# EAGLE design gardener (EAGLE 7.6.0)
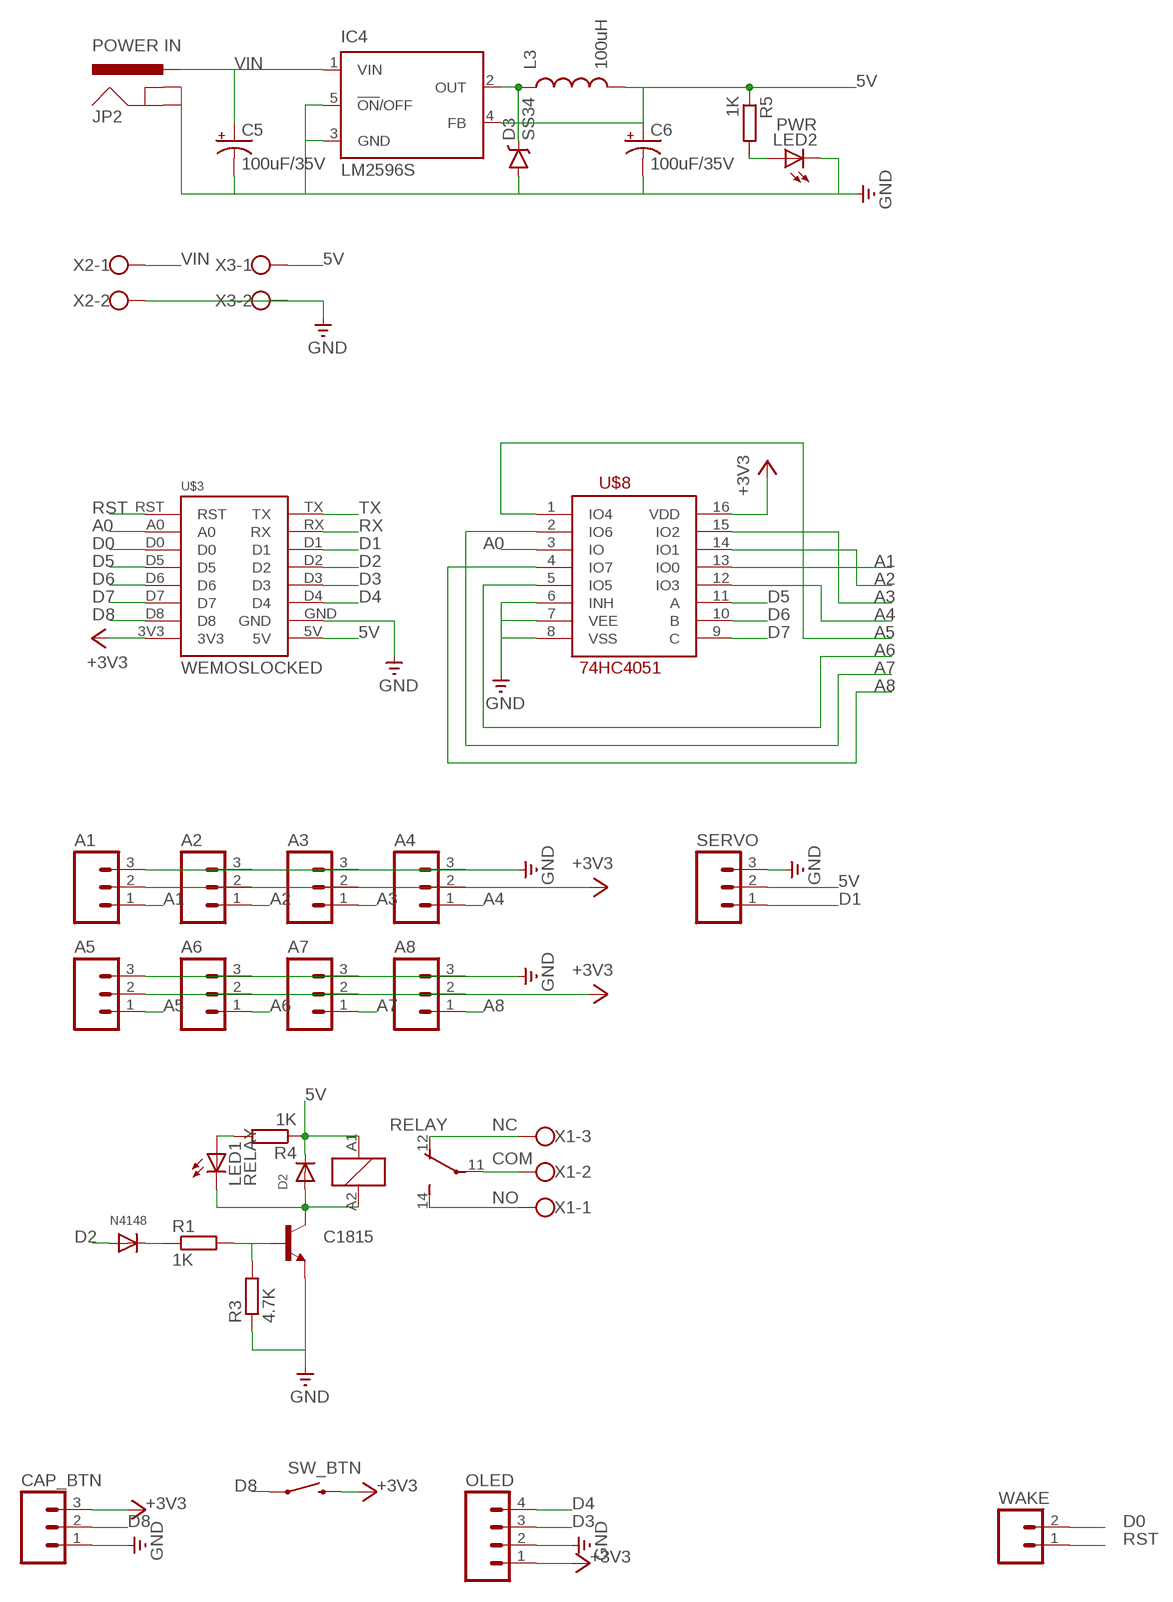
[diagram p0: schematic, sheet 1]

## Parts
A1  M03PTH  [1X03]
A2  M03PTH  [1X03]
A3  M03PTH  [1X03]
A4  M03PTH  [1X03]
A5  M03PTH  [1X03]
A6  M03PTH  [1X03]
A7  M03PTH  [1X03]
A8  M03PTH  [1X03]
C5  100uF/35V  CAP_POLD  [PANASONIC_D]
C6  100uF/35V  CAP_POLD  [PANASONIC_D]
C1815  TRANSISTOR_NPNSOT23-3  [SOT23-3]
CAP_BTN  M03PTH  [1X03]
D2  DIODESMA  [SMADIODE]
D3  SS34  MBRA140  [SMA-DIODE]
IC4  LM2596S  [TO263-5]
JP2  POWER IN  POWER_JACKPTH  [POWER_JACK_PTH]
L3  100uH  INDUCTORSDR13-7-270ML  [INDUCTOR_SDR1307]
LED1  RELAY  LED3MM  [LED3MM]
LED2  PWR  LED3MM  [LED3MM]
N4148  DIODESOD-123  [SOD-123]
OLED  M04PTH  [1X04]
R1  1K  R-EU_R0805  [R0805]
R3  4.7K  R-EU_R0805  [R0805]
R4  1K  R-EU_R0805  [R0805]
R5  1K  R-EU_R0805  [R0805]
RELAY  ZNS5106  [ZN5]
SERVO  M03PTH  [1X03]
SW_BTN  SWITCH-MOMENTARY-212MM  [TACTILE-PTH-12MM]
U$3  WEMOSLOCKED  [WEMOS_LOCKED]
U$8  74HC4051  [74HC4051]
WAKE  M02PTH  [1X02]
X1  W237-103  [W237-103]
X2  W237-102  [W237-102]
X3  W237-102  [W237-102]

## Nets
5V: C6.+ D2.C IC4.4(FB) L3.P$2 R4.1 R5.1 RELAY.A1 SERVO.2 U$3.5V X3.1
+3V3: A1.2 A2.2 A3.2 A4.2 A5.2 A6.2 A7.2 A8.2 CAP_BTN.3 OLED.1 SW_BTN.3 U$3.3V3 U$8.16(VDD)
A0: U$3.A0 U$8.3(IO)
A1: A1.1 U$8.13(IO0)
A2: A2.1 U$8.14(IO1)
A3: A3.1 U$8.15(IO2)
A4: A4.1 U$8.12(IO3)
A5: A5.1 U$8.1(IO4)
A6: A6.1 U$8.5(IO5)
A7: A7.1 U$8.2(IO6)
A8: A8.1 U$8.4(IO7)
COM: RELAY.11(2:P) X1.2
D0: U$3.D0 WAKE.2
D1: SERVO.1 U$3.D1
D2: N4148.A U$3.D2
D3: OLED.3 U$3.D3
D4: OLED.4 U$3.D4
D5: U$3.D5 U$8.11(A)
D6: U$3.D6 U$8.10(B)
D7: U$3.D7 U$8.9(C)
D8: CAP_BTN.2 SW_BTN.1 U$3.D8
GND: A1.3 A2.3 A3.3 A4.3 A5.3 A6.3 A7.3 A8.3 C5.- C6.- C1815.2(E) CAP_BTN.1 D3.A IC4.3(GND) IC4.5(!ON!/OFF) JP2.GND JP2.GNDBREAK LED2.K(C) OLED.2 R3.1 SERVO.3 U$3.GND U$8.6(INH) U$8.7(VEE) U$8.8(VSS) X2.2 X3.2
N$1: C1815.3(C) D2.A LED1.K(C) RELAY.A2
N$2: N4148.C R1.1
N$3: LED1.A R4.2
N$4: LED2.A R5.2
N$7: C1815.1(B) R1.2 R3.2
N$9: D3.C IC4.2(OUT) L3.P$1
NC: RELAY.12(2:O) X1.3
NO: RELAY.14(2:S) X1.1
RST: U$3.RST WAKE.1
RX: U$3.RX
TX: U$3.TX
VIN: C5.+ IC4.1(VIN) JP2.PWR X2.1

## Library data of the parts
A1-A8 CAP_BTN SERVO = SparkFun-Connectors:M03: Header 3 Standard 3-pin 0.1" header. Use with straight break away headers (SKU : PRT-00116), right angle break away headers (PRT-00553), swiss pins (PRT-00743), machine pins (PRT-00117), and female headers (PRT-00115). Molex polarized connector foot print use with SKU : PRT-08232 with associated crimp pins and housings.
C5 C6 = SparkFun-Passives:CAP_POL: Capacitor Polarized These are standard SMD and PTH capacitors. Normally 10uF, 47uF, and 100uF in electrolytic and tantalum varieties. Always verify the external diameter of the through hole cap, it varies with capacity, voltage, and manufacturer. The EIA devices should be standard.
C1815 = SparkFun-DiscreteSemi:TRANSISTOR_NPN: Generic NPN BJT MMBT2222A - TRANS-08049 (SOT-23, 1A 40V) MPSA42 - TRANS-09116 (SOT-23, 500mA 300V) MMBT5088LT1G - TRANS-11160 (SOT-23, 50 mA 30V) BC547 - COM-08928 <http://www.sparkfun.com/products/8928> (TO-92 45V 100mA) (1.Collector 2.Base 3.Emitter) 2N3904 - COM-00521 <http://www.sparkfun.com/products/521> (TO-92 40V 200mA) (1.Emitter 2.Base 3.Collector) P2N2222A - COM-12852 <http://www.sparkfun.com/products/12852> (TO-92 40V 600mA) (1.Collector 2.Base 3.Emitter); PROD_ID: TRANS-08049
D2 N4148 = adafruit:DIODE: Diode SMADIODE - SMA Surface Mount Package 20V 1A Schottky Diode Digikey: 641-1014-6-ND DO-1N4148 - Through Hole Small Current Diode SOD-123 20V 1 A (.5mV Vf) Schottky Diode - Digikey: MBRX120TPMSCT-ND SOD-323 10V 570mA (.38mV Vf, 3ns) Schottky Diode - Digikey: ZLLS410CT-ND SOD-523 30V 30mA Schottky Diode (RB751S-40TE61) - Digikey: RB751S-40TE61CT-ND SOT23-R/W - SOT23 Package (R = Solder Paste/Reflow Ovens, W = Hand-Soldering) BAT54Film 40V 300mA - Digikey: 497-7162-1-ND
D3 = SparkFun-DiscreteSemi:MBRA140: 40V, 1A Schottky rectifier SMA/DO-214AC package DIO-08053; PROD_ID: DIO-08053
IC4 = national-semiconductor:LM2596: SIMPLE SWITCHER® Power Converter 150 kHz 3A Step-Down Voltage Regulator Source: http://www.national.com/ds/LM/LM2596.pdf; MF: NATIONAL SEMICONDUCTOR; MPN: LM2596S-ADJ/NOPB; OC_FARNELL: 9494367; OC_NEWARK: 41K3842
JP2 = SparkFun-Connectors:POWER_JACK: Power Jack This is the standard 5.5mm barrel jack for power. The PTH is the most common, proven, reliable, footprint. The Slot footprint only works if the mill layer is transmitted to the PCB fab house so be warned. Mating wall wart : TOL-00298 (and others); PROD_ID: CONN-08197
L3 = SparkFun-Passives:INDUCTOR: Inductors Basic Inductor/Choke - 0603 and 1206. Footprints are not proven and vary greatly between part numbers. SRN6045- 33uH, 20% 1.4A SDR0403-560KL - 56uH, 10%, 500mA RMS/740mA peak; PROD_ID: NDUC-12529; VALUE: 27uH
LED1 LED2 = adafruit:LED: LED OSRAM: - CHIPLED LG R971, LG N971, LY N971, LG Q971, LY Q971, LO R971, LY R971 LH N974, LH R974 LS Q976, LO Q976, LY Q976 LO Q996 - Hyper CHIPLED LW Q18S LB Q993, LB Q99A, LB R99A - SideLED LS A670, LO A670, LY A670, LG A670, LP A670 LB A673, LV A673, LT A673, LW A673 LH A674 LY A675 LS A676, LA A676, LO A676, LY A676, LW A676 LS A679, LY A679, LG A679 - Hyper Micro SIDELED® LS Y876, LA Y876, LO Y876, LY Y876 LT Y87S - SmartLED LW L88C, LW L88S LB L89C, LB L89S, LG L890 LS L89K, LO L89K, LY L89K LS L896, LA L896, LO L896, LY L896 - TOPLED LS T670, LO T670, LY T670, LG T670, LP T670 LSG T670, LSP T670, LSY T670, LOP T670, LYG T670 LG T671, LOG T671, LSG T671 LB T673, LV T673, LT T673, LW T673 LH T674 LS T676, LA T676, LO T676, LY T676, LB T676, LH T676, LSB T676, LW T676 LB T67C, LV T67C, LT T67C, LS T67K, LO T67K, LY T67K, LW E67C LS E67B, LA E67B, LO E67B, LY E67B, LB E67C, LV E67C, LT E67C LW T67C LS T679, LY T679, LG T679 LS T770, LO T770, LY T770, LG T770, LP T770 LB T773, LV T773, LT T773, LW T773 LH T774 LS E675, LA E675, LY E675, LS T675 LS T776, LA T776, LO T776, LY T776, LB T776 LHGB T686 LT T68C, LB T68C - Hyper Mini TOPLED® LB M676 - Mini TOPLED Santana® LG M470 LS M47K, LO M47K, LY M47K Source: http://www.osram.convergy.de/
OLED = SparkFun-Connectors:M04: Header 4 Standard 4-pin 0.1" header. Use with straight break away headers (SKU : PRT-00116), right angle break away headers (PRT-00553), swiss pins (PRT-00743), machine pins (PRT-00117), and female headers (PRT-00115). Molex polarized connector foot print use with SKU : PRT-08231 with associated crimp pins and housings. 1MM SMD Version SKU: PRT-10208
R1 R3-R5 = rcl:R-EU_: RESISTOR, European symbol
RELAY = relay:ZNS5*: Miniature Power PCB Relay SCHRACK 1pole 10 A Source: http://www.schrack.com/.. 5847.pdf; OC_FARNELL: unknown; OC_NEWARK: unknown
SW_BTN = SparkFun-Electromechanical:SWITCH-MOMENTARY-2: Various NO switches- pushbuttons, reed, etc; PROD_ID: SWCH-09185
U$3 = My Eagle Lib:WEMOS
U$8 = My Eagle Lib:74HC4051
WAKE = SparkFun-Connectors:M02: Standard 2-pin 0.1" header. Use with - straight break away headers ( PRT-00116) - right angle break away headers (PRT-00553) - swiss pins (PRT-00743) - machine pins (PRT-00117) - female headers (PRT-00115) Molex polarized connector foot print use with: PRT-08233 with associated crimp pins and housings. 2.54_SCREWTERM for use with PRT-10571. 3.5mm Screw Terminal footprints for PRT-08084 5mm Screw Terminal footprints for use with PRT-08432
X1 = con-wago-500:W237-103: WAGO SCREW CLAMP; MPN: 237-103; OC_FARNELL: unknown; OC_NEWARK: 18M7116
X2 X3 = con-wago-500:W237-102: WAGO SCREW CLAMP; MPN: 237-102; OC_FARNELL: unknown; OC_NEWARK: 70K9898

## Board
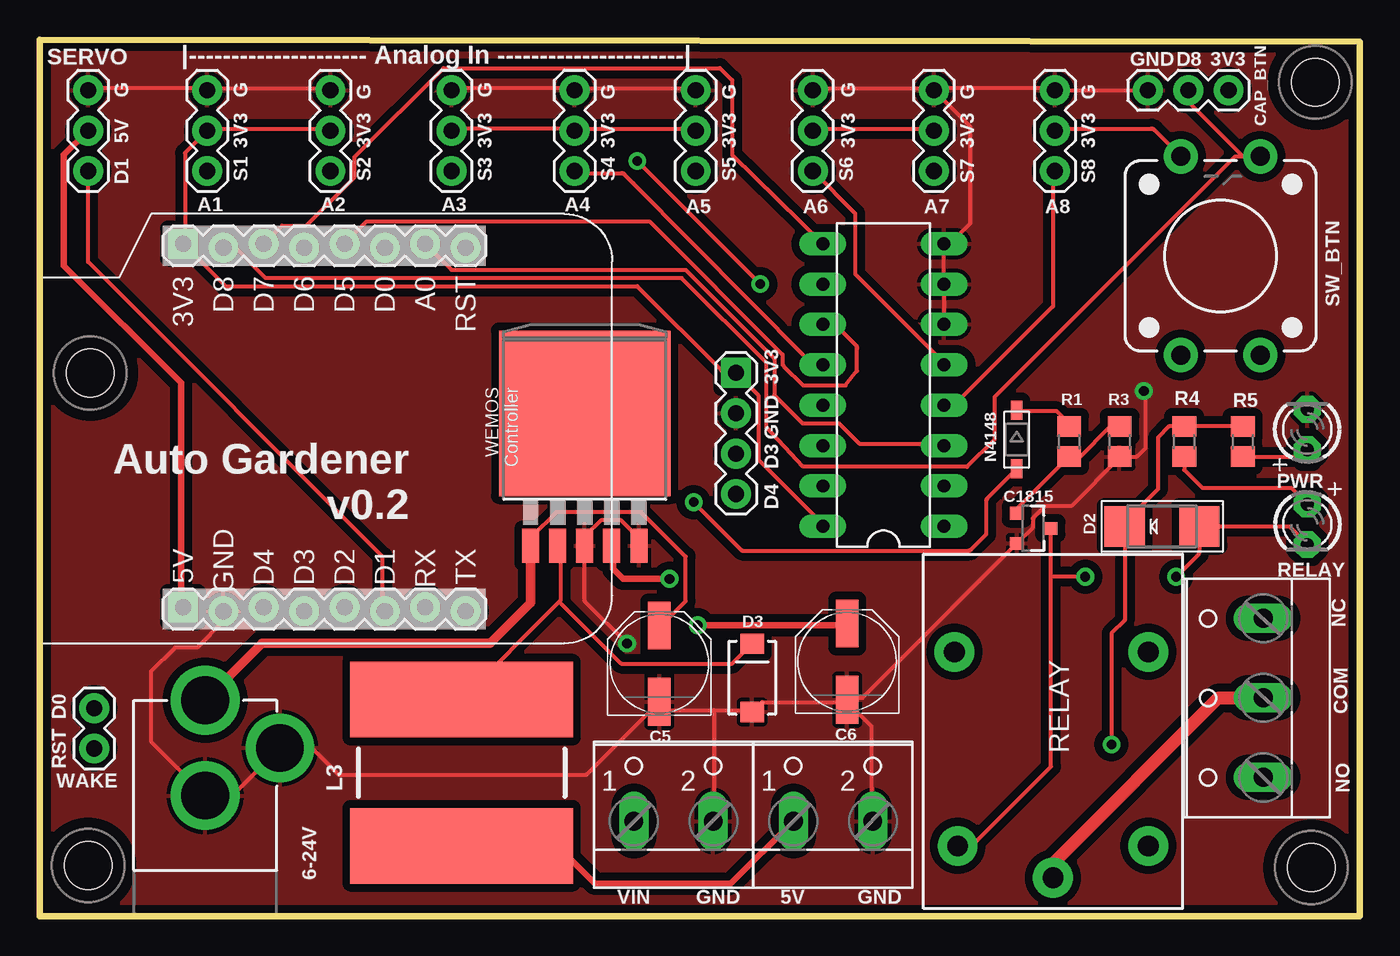
[diagram p1: board, top side]
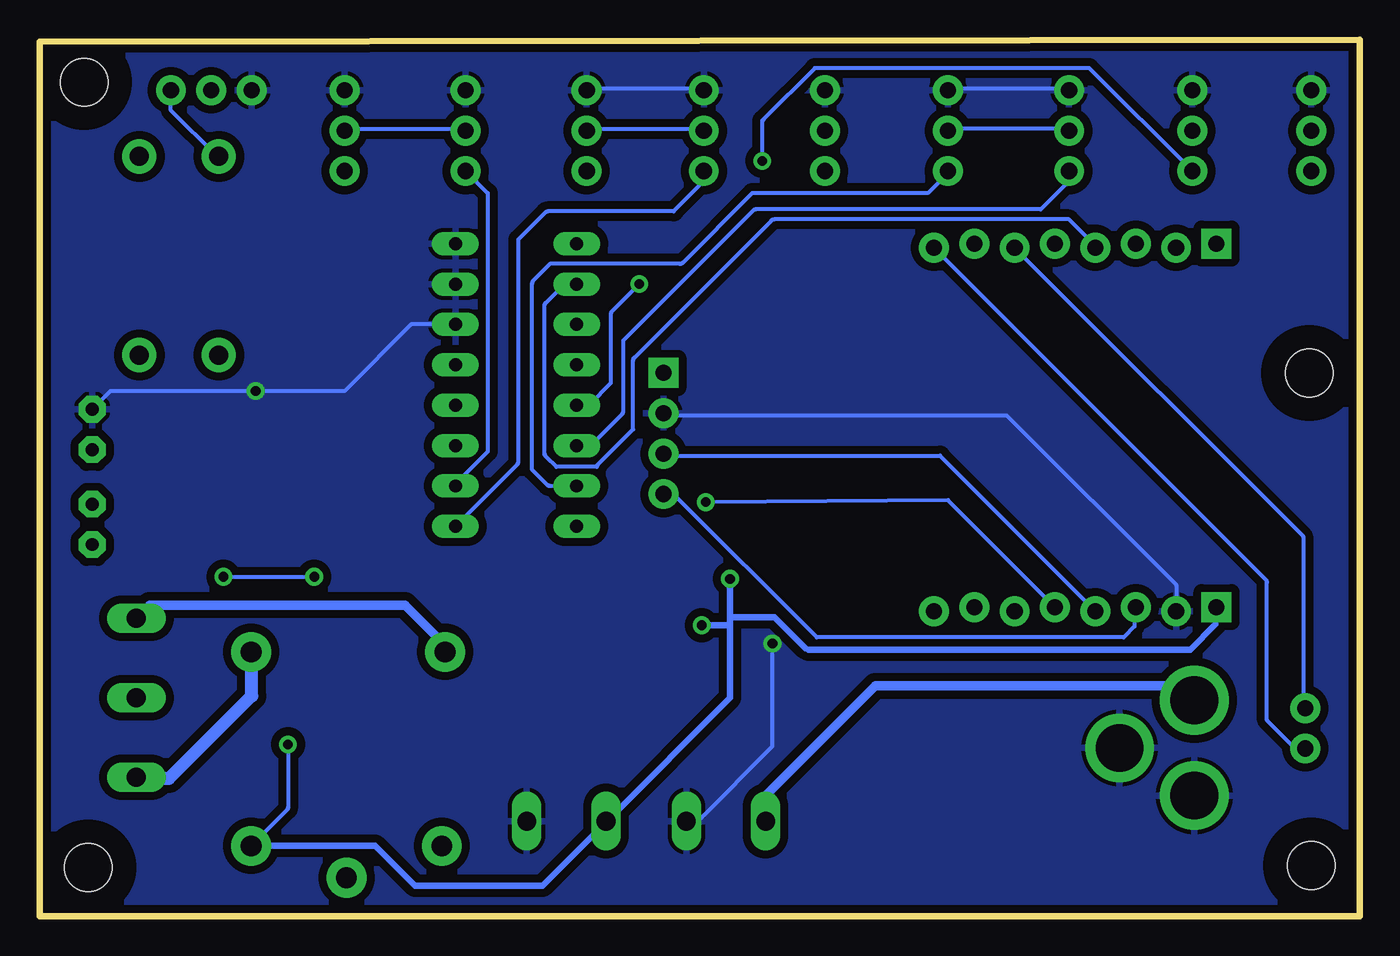
[diagram p2: board, bottom side, seen from below]

Size 83.06 x 55.12 mm. Coordinates in mm from the lower left corner, seen from the top.
Outline: 0,0 83.06,0 83.06,54.99 0,55.12 0,0
Copper layers (1*16): Top 0.035mm / dielectric 1.5mm / Bottom 0.035mm
Design rules "kha thanh": minimum track width 10mil, minimum drill 24mil, track to track 10mil, track to pad 10mil, pad to pad 10mil, via to via 10mil, smd to smd 8mil, copper to edge 20mil, drill to drill 12mil, minimum pad ring 13mil, minimum via ring 10mil, stop-mask expansion 4mil, vias tented up to drill 0mil, thermal gap 10mil

### Footprints (pad centres in the part's own frame; a part is rotated, then mirrored left to right if it is on the bottom)
1X03 = drill 1.016 pad 1.88: 1 0,0; 2 2.54,0; 3 5.08,0
PANASONIC_D = smd 3 x 1.4: + 2.4,0; - -2.4,0
SOT23-3 = smd 0.8 x 0.9: 1 -0.95,-1; 2 0.95,-1; 3 0,1.1
SMADIODE = smd 2.54 x 2.54: A 2.349,0; C -2.349,0
SMA-DIODE = smd 1.27 x 1.47: A -2.15,0; C 2.15,0
TO263-5 = smd 1.067 x 2.159: 1 -3.404,-5.791; 2 -1.702,-5.791; 3 0,-5.791; 4 1.702,-5.791; 5 3.404,-5.791 | smd 10.8 x 10.41: 6 0,2.54
POWER_JACK_PTH = drill 2.997 pad 4.318: GND 0,7.7; GNDBREAK 4.7,10.7; PWR 0,13.7
INDUCTOR_SDR1307 = smd 14 x 4.75: P$1 0,4.6; P$2 0,-4.6
LED3MM = drill 0.813 pad 1.676 octagon: A -1.27,0; K 1.27,0
SOD-123 = smd 1.2 x 0.7: A 1.85,0; C -1.85,0
1X04 = drill 1.016 pad 1.88 square: 1 0,0 | drill 1.016 pad 1.88: 2 2.54,0; 3 5.08,0; 4 7.62,0
R0805 = smd 1.3 x 1.5: 1 -0.95,0; 2 0.95,0
ZN5 = drill 1.3 pad 2.5: 11 8.89,0; 12 -5.31,-6.2; 14 -5.31,6; A1 6.89,6; A2 6.89,-6
TACTILE-PTH-12MM = drill 1.2 pad 2.159: 1 6.25,-2.5; 2 -6.25,-2.5; 3 6.25,2.5; 4 -6.25,2.5
KFH-M3 = hole 3: 0,0
WEMOS_LOCKED = drill 1.016 pad 1.88 square: 3V3 -0.127,0; 5V 22.733,0 | drill 1.016 pad 1.88: A0 -0.127,15.24; D0 0.127,12.7; D1 22.987,12.7; D2 22.733,10.16; D3 22.987,7.62; D4 22.733,5.08; D5 -0.127,10.16; D6 0.127,7.62; D7 -0.127,5.08; D8 0.127,2.54; GND 22.987,2.54; RST 0.127,17.78; RX 22.733,15.24; TX 22.987,17.78
74HC4051 = drill 0.813 long: 1 -8.89,-3.81; 2 -6.35,-3.81; 3 -3.81,-3.81; 4 -1.27,-3.81; 5 1.27,-3.81; 6 3.81,-3.81; 7 6.35,-3.81; 8 8.89,-3.81; 9 8.89,3.81; 10 6.35,3.81; 11 3.81,3.81; 12 1.27,3.81; 13 -1.27,3.81; 14 -3.81,3.81; 15 -6.35,3.81; 16 -8.89,3.81
1X02 = drill 1.016 pad 1.88: 1 0,0; 2 2.54,0
W237-103 = drill 1.194 long: 1 -5,-1.29; 2 0,-1.29; 3 5,-1.29
W237-102 = drill 1.194 long: 1 -2.5,-1.27; 2 2.5,-1.27

### Placement (x,y rotation side)
A1  10.54,46.86 90 top
A2  18.29,46.86 90 top
A3  25.91,46.86 90 top
A4  33.66,46.86 90 top
A5  41.28,46.86 90 top
A6  48.64,46.86 90 top
A7  56.26,46.86 90 top
A8  63.88,46.86 90 top
C5  38.99,15.88 90 top
C6  50.8,16 90 top
C1815  62.48,24.38 270 top
CAP_BTN  69.72,51.94 0 top
D2  70.61,24.51 0 top
D3  44.83,14.99 90 top
IC4  34.29,29.08 0 top
JP2  10.41,-0.13 0 top
L3  26.54,9.02 0 top
LED1  79.76,24.64 270 top
LED2  79.76,30.61 90 top
N4148  61.47,29.97 270 top
OLED  43.82,34.16 270 top
R1  64.77,29.84 270 top
R3  67.94,29.84 90 top
R4  72.01,29.84 270 top
R5  75.69,29.84 270 top
RELAY  63.75,11.3 270 top
SERVO  3.05,46.86 90 top
SW_BTN  74.3,41.53 90 top
U$2  [KFH-M3]  80.26,52.45 0 top
U$3  9.02,42.16 270 top
U$5  [KFH-M3]  3.17,34.16 0 top
U$6  [KFH-M3]  80.01,3.05 0 top
U$7  [KFH-M3]  3.05,3.17 0 top
U$8  53.09,33.4 90 top
WAKE  3.43,10.54 90 top
X1  75.69,13.72 90 top
X2  39.88,7.24 0 top
X3  49.91,7.24 0 top

### Tracks (layer width: path | path; a pad name or v marks a point on that pad's centre or on a via)
5V  (via drill 0.61)
  Top 0.254: 36.07,22.61 36.07,23.11 IC4.4 | 50.8,18.29 C6.+ | 8.89,19.56 U$3.5V | L3.P$2 32.54,4.42 | R5.1 R4.1 71.05,30.79 70.36,30.1 70.36,26.86 68.26,24.77 D2.C 68.26,18.61 67.44,17.78 v67.44,10.8
  Top 0.406: v39.62,21.21 36.7,21.21 36.07,21.84 36.07,22.61 | v41.4,18.29 50.8,18.29 | SERVO.2 1.52,47.88 1.52,40.89 8.89,33.53 8.89,19.56 | 32.54,4.42 34.93,2.03 43.47,2.03 X3.1
  Bottom 0.254: 47.24,6.1 X3.1 47.5,5.84 | 69.6,4.32 RELAY.A1 67.51,6.66 arc-45 67.44,6.83 v67.44,10.8 | U$3.5V 9.02,18.52 arc45 9.09,18.34 | 34.69,16.76 arc45 34.87,16.84
  Bottom 0.406: 39.62,18.29 39.62,13.72 47.24,6.1 | 39.62,18.29 39.62,18.8 | 39.62,18.8 v39.62,21.21 | 39.62,18.29 v41.4,18.29 | 34.87,16.84 36.83,18.8 39.62,18.8 | 47.5,5.84 51.44,1.91 59.44,1.91 61.94,4.41 RELAY.A1 | 9.09,18.34 10.67,16.76 34.69,16.76
+3V3
  Top 0.254: A8.2 64.01,49.53 69.94,49.53 arc-45 70.12,49.46 SW_BTN.3 | A3.2 25.91,49.53 33.53,49.53 A4.2 33.78,49.53 41.15,49.53 A5.2 | A7.2 56.13,49.53 48.77,49.53 A6.2 | U$8.16 49.28,24.64 45.21,28.7 45.21,32.77 OLED.1 43.69,34.29 42.93,34.29 37.59,39.62 11.68,39.62 U$3.3V3 9.14,42.42 9.14,48.01 A1.2 10.67,49.53 18.29,49.53 A2.2
  Bottom 0.254: A7.2 56.39,49.53 63.75,49.53 A8.2 | A5.2 41.4,49.53 48.51,49.53 A6.2 | A3.2 25.91,49.53 18.29,49.53 A2.2 | SW_BTN.3 71.91,47.78 74.8,50.67 CAP_BTN.3
A0
  Top 0.254: U$3.A0 25.91,40.64 40.64,40.64 46.23,35.05 46.23,32.77 48.01,30.99 50.29,30.99 51.56,29.72 56.9,29.72 U$8.3
A1  (via drill 0.61)
  Top 0.254: v45.34,39.75 v37.59,47.5
  Bottom 0.254: 37.52,50.11 34.29,53.34 17.02,53.34 A1.1 | 37.52,50.11 37.59,50.04 | U$8.13 48.62,32.13 arc-45 48.44,32.2 47.12,33.53 47.12,37.87 arc45 47.04,38.05 v45.34,39.75 | v37.59,47.5 37.59,49.93 arc45 37.52,50.11
A2
  Bottom 0.254: 49.28,29.72 U$8.14 48.39,29.59 46.43,31.55 arc-45 46.36,31.73 46.36,36.2 38.17,44.38 arc45 38,44.45 20.07,44.45 18.36,46.15 arc-45 18.29,46.33 A2.1
A3
  Bottom 0.254: A3.1 25.91,46.74 27.18,45.47 38.23,45.47 42.6,41.1 arc45 42.78,41.02 50.95,41.02 52,39.98 arc-45 52.07,39.8 52.07,28.07 51.13,27.12 arc-45 50.95,27.05 U$8.15
A4
  Top 0.254: A4.1 33.78,46.74 36.6,46.74 arc-45 36.78,46.66 37.34,46.1 48.26,35.05 48.79,35.05 arc-45 48.97,34.98 U$8.12
A5
  Bottom 0.254: 56.9,24.64 U$8.1 53.03,28.37 arc-45 52.96,28.55 52.96,42.55 51.26,44.25 arc45 51.08,44.32 43.18,44.32 41.35,46.15 arc-45 41.28,46.33 A5.1
A6
  Top 0.254: A6.1 51.31,44.2 51.31,40.39 56.9,34.8 U$8.5
A7
  Bottom 0.254: A7.1 54.86,45.47 54.86,29.21 56.9,27.18 U$8.2
A8
  Top 0.254: A8.1 63.75,46.74 63.75,38.35 57.66,32.26 56.9,32.26 U$8.4
COM
  Top 0.813: RELAY.11 63.75,3.3 74.17,13.72 X1.2
D0
  Bottom 0.254: U$3.D0 3.56,23.88 3.56,13.21 WAKE.2
D1
  Top 0.254: SERVO.1 3.05,41.15 21.59,22.61 21.59,19.3 U$3.D1
D2  (via drill 0.61)
  Top 0.254: v41.15,26.04 44.2,22.99 58.44,22.99 arc45 58.62,23.06 59.56,24 59.56,26.11 arc-45 59.64,26.29 N4148.A 61.47,27.94
  Bottom 0.254: v41.15,26.04 25.91,26.16 U$3.D2
D3
  Bottom 0.254: U$3.D3 26.42,28.96 43.69,28.96 OLED.3
D4
  Bottom 0.254: U$3.D4 14.1,18.77 arc45 14.17,18.59 14.17,18.21 14.86,17.53 34.16,17.53 43.18,26.54 OLED.4
D5
  Top 0.254: U$3.D5 20.57,43.69 38.35,43.69 46.74,35.31 46.74,34.78 arc45 46.81,34.6 48.03,33.38 50.7,33.38 51.44,34.29 51.44,35.71 arc45 51.36,35.89 50.04,37.21 U$8.11
D6
  Bottom 0.254: U$3.D6 16.64,42.06 arc-45 16.71,42.24 18.29,43.82 36.85,43.82 arc-45 37.03,43.74 45.65,35.13 arc-45 45.72,34.95 45.72,30.61 47.95,28.38 arc-45 48.01,28.24 50.55,28.24 51.23,28.93 arc45 51.31,29.11 51.31,38.38 arc45 51.23,38.55 50.04,39.75 U$8.10
D7
  Top 0.254: U$8.9 43.56,47.88 43.56,52.58 42.8,53.34 25.4,53.34 19.81,47.75 19.81,46.48 16.76,43.43 15.24,43.43 U$3.D7
D8
  Top 0.254: U$3.D8 11.68,41.91 12.45,41.91 14.22,40.13 40.39,40.13 45.72,34.8 45.72,30.73 48.03,28.27 58.34,28.24 60.07,29.97 60.07,32.64 75.18,47.75 76.73,47.75 arc45 SW_BTN.1 75.69,47.78 72.26,51.21 CAP_BTN.2
GND  (via drill 0.61)
  Top 0.254: U$8.6 U$8.7 U$8.8 57.28,42.29 58.55,43.56 58.55,49.66 A7.3 | A7.3 56.39,52.07 63.75,52.07 A8.3 CAP_BTN.1 | SERVO.3 3.05,52.07 10.41,52.07 A1.3 10.67,52.07 18.29,52.07 A2.3 | A3.3 25.91,52.07 33.53,52.07 A4.3 33.78,52.07 41.15,52.07 A5.3 | A7.3 56.13,52.07 48.77,52.07 A6.3 | IC4.5 37.59,23.37 37.59,23.88 36.58,24.89 35.31,24.89 34.29,23.88 IC4.3 34.29,19.81 v36.96,17.14 | 42.42,12.95 39.62,12.95 39.12,13.46 C5.- 34.4,8.89 18.8,8.89 17.11,10.57 JP2.GNDBREAK 12.11,7.57 JP2.GND 6.98,11 6.98,15.37 8.51,16.89 9.91,16.89 11.56,18.54 U$3.GND | 42.42,12.95 44.7,12.95 D3.A 44.96,12.95 45.47,13.46 50.8,13.46 | 50.8,13.46 52.32,11.94 52.32,6.1 X3.2 | 50.8,13.46 C6.- 50.8,13.72 51.77,13.72 C1815.2 | 42.42,12.95 42.42,6.1 X2.2 | 59.13,21.08 C1815.2 | C1815.2 62.48,24.43 62.48,25.02 63.25,25.78 64.9,25.78 67.94,28.83 R3.1 69.03,28.89 69.6,29.46 69.6,32.89 v69.47,33.02
  Bottom 0.254: A5.3 41.4,52.07 48.51,52.07 A6.3 | A2.3 18.29,52.07 25.91,52.07 A3.3 | X2.2 42.16,6.1 41.53,6.1 36.96,10.67 v36.96,17.14 | U$8.6 59.69,37.21 63.88,33.02 v69.47,33.02 78.61,33.02 LED2.K | U$3.GND 11.56,20.83 22.22,31.5 43.69,31.5 OLED.2
  pour Top (isolate 0.508): -9.02,60.96 85.85,62.74 85.98,-10.67 -8.89,-12.45
  pour Bottom (isolate 0.508): -8.89,60.71 86.23,62.61 86.36,-10.67 -8.76,-12.57
N$1  (via drill 0.61)
  Top 0.254: 74.1,23.37 D2.A | D2.A 78.61,24.51 LED1.K | RELAY.A2 58.64,4.41 63.63,9.4 63.63,21.34 | 63.63,21.34 63.63,24.34 C1815.3 | D2.A 72.96,22.9 arc-45 72.89,22.72 v71.5,21.34 | v65.79,21.34 63.63,21.34
  Bottom 0.254: v71.5,21.34 v65.79,21.34
N$2
  Top 0.254: N4148.C 61.47,31.75 64.01,31.75 64.77,30.99 R1.1
N$3
  Top 0.254: R4.2 72.01,28.07 73.15,26.92 78.74,26.92 LED1.A
N$4
  Top 0.254: R5.2 79.31,28.89 LED2.A
N$7
  Top 0.254: C1815.1 61.48,25.61 R1.2 65.47,28.89 67.31,30.73 67.88,30.73 R3.2
N$9
  Top 0.254: 44.7,17.02 D3.C 43.57,15.88 36.58,15.88 32.69,19.76 | IC4.2 32.77,23.11 32.77,19.84 32.69,19.76 | 26.67,13.72 L3.P$1 32.69,19.76
NC
  Bottom 0.61: RELAY.12 57.55,17.04 60.07,19.56 76.14,19.56 X1.3
NO
  Bottom 0.813: X1.1 76.9,8.64 74.93,8.64 69.72,13.84 69.72,16.58 RELAY.14
RST
  Bottom 0.254: U$3.RST 5.92,21.16 arc45 5.84,20.98 5.84,12.32 4.27,10.74 arc-45 4.09,10.67 3.56,10.67 WAKE.1
VIN
  Top 0.254: IC4.1 30.99,23.37 30.99,23.88 32.51,25.4 37.85,25.4 40.64,22.61 40.64,19.81 39.12,18.29 C5.+
  Top 0.61: IC4.1 30.89,19.71 28.32,17.14 13.99,17.14 JP2.PWR
  Bottom 0.61: X2.1 37.38,7.58 30.48,14.48 11.32,14.48 JP2.PWR

### Text on the board
tPlace: SW_BTN | 6-24V
tNames: |--------------------- Analog In ----------------------| | GND | D8 | 3V3 | G | G | G | G | G | G | G | G | G | 5V | 3V3 | 3V3 | 3V3 | 3V3 | 3V3 | 3V3 | 3V3 | 3V3 | D1 | S1 | S2 | S3 | S4 | S5 | S6 | S7 | S8 | A1 | A2 | A3 | A4 | A5 | A6 | A7 | A8 | 3V3 | GND | Auto Gardener / v0.2 | D3 | D4 | NC | D0 | COM | RST | NO | VIN | GND | 5V | GND